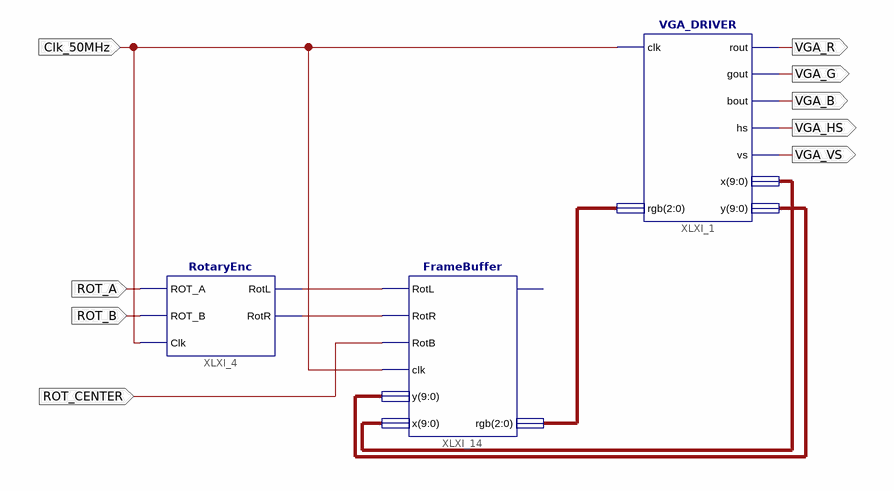
[diagram p0: schematic sheet 1]
// Xilinx ISE schematic main_sch.sch (spartan3e) as structural Verilog: 3 symbols, 9 ports
module main_sch (
  input  ROT_A,
  input  ROT_B,
  input  Clk_50MHz,
  input  ROT_CENTER,
  output VGA_R,
  output VGA_G,
  output VGA_B,
  output VGA_HS,
  output VGA_VS
);

  wire XLXN_4, XLXN_5;
  wire [2:0] XLXN_14;
  wire [9:0] XLXN_15, XLXN_16;

  VGA_DRIVER XLXI_1 (
    .clk(Clk_50MHz), .rgb(XLXN_14), .rout(VGA_R), .gout(VGA_G), .bout(VGA_B), .hs(VGA_HS), .vs(VGA_VS),
    .x(XLXN_15), .y(XLXN_16));
  RotaryEnc XLXI_4 (.ROT_A(ROT_A), .ROT_B(ROT_B), .RotL(XLXN_4), .RotR(XLXN_5), .Clk(Clk_50MHz));
  FrameBuffer XLXI_14 (
    .RotL(XLXN_4), .RotR(XLXN_5), .RotB(ROT_CENTER), .clk(Clk_50MHz), .y(XLXN_16), .x(XLXN_15), .rgb(XLXN_14));  // open: clk_out
endmodule
